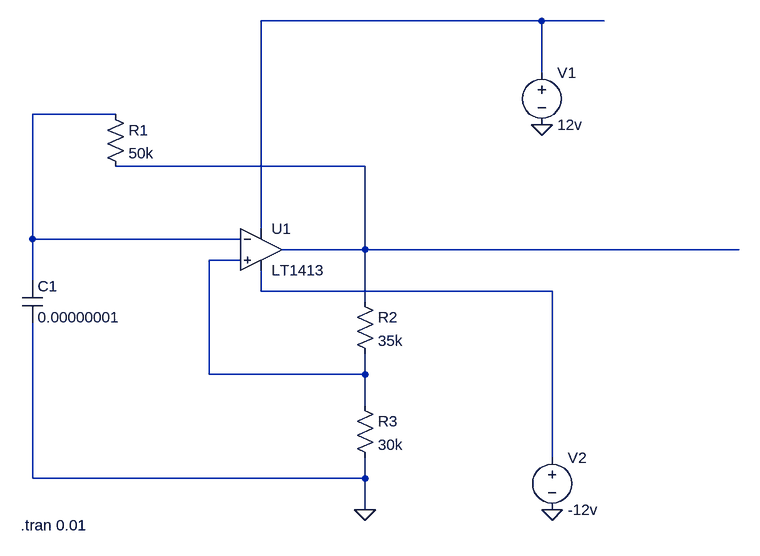
[diagram p0: schematic Draft6.asc]
Draft6.asc, the LTspice schematic file:
Version 4
SHEET 1 1172 680
WIRE 864 -240 432 -240
WIRE 960 -240 864 -240
WIRE 864 -160 864 -240
WIRE 208 -96 80 -96
WIRE 592 -16 208 -16
WIRE 432 80 432 -240
WIRE 80 96 80 -96
WIRE 400 96 80 96
WIRE 592 112 592 -16
WIRE 592 112 464 112
WIRE 1168 112 592 112
WIRE 400 128 352 128
WIRE 80 160 80 96
WIRE 432 176 432 144
WIRE 880 176 432 176
WIRE 592 192 592 112
WIRE 352 304 352 128
WIRE 592 304 592 272
WIRE 592 304 352 304
WIRE 592 352 592 304
WIRE 880 432 880 176
WIRE 80 464 80 224
WIRE 592 464 592 432
WIRE 592 464 80 464
WIRE 592 512 592 464
FLAG 592 512 0
FLAG 880 512 0
FLAG 864 -80 0
SYMBOL cap 64 160 R0
SYMATTR InstName C1
SYMATTR Value 0.00000001
SYMBOL res 192 -112 R0
SYMATTR InstName R1
SYMATTR Value 50k
SYMBOL OpAmps\\LT1413 432 48 R0
SYMATTR InstName U1
SYMBOL res 576 176 R0
SYMATTR InstName R2
SYMATTR Value 35k
SYMBOL res 576 336 R0
SYMATTR InstName R3
SYMATTR Value 30k
SYMBOL voltage 864 -176 R0
WINDOW 123 0 0 Left 0
WINDOW 39 0 0 Left 0
SYMATTR InstName V1
SYMATTR Value 12v
SYMBOL voltage 880 416 R0
WINDOW 123 0 0 Left 0
WINDOW 39 0 0 Left 0
SYMATTR InstName V2
SYMATTR Value -12v
TEXT 62 536 Left 2 !.tran 0.01

The netlist it stands for:
* Draft6.asc
C1 N002 0 0.00000001
R1 N002 N003 50k
XU1 N004 N002 N001 N005 N003 LT1413  ; pins In+ In- V+ V- OUT
R2 N003 N004 35k
R3 N004 0 30k
V1 N001 0 12v
V2 N005 0 -12v
.tran 0.01
.lib LTC.lib
.backanno
.end